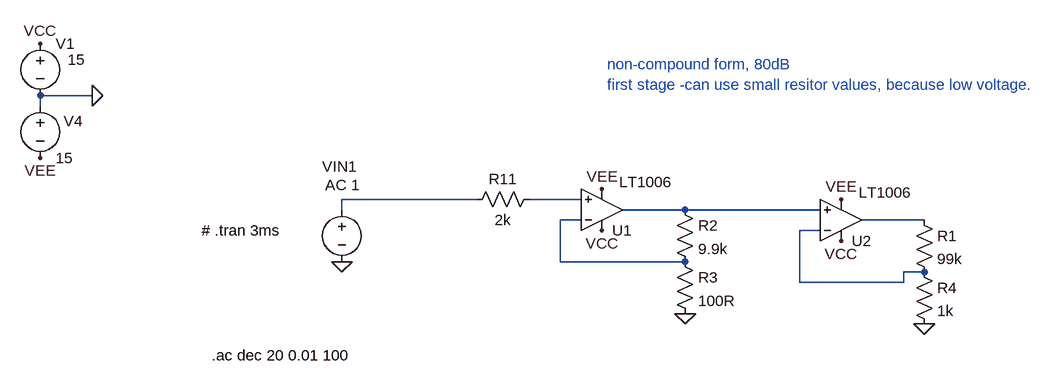
[diagram p0: schematic Draft03.asc]
Draft03.asc, the LTspice schematic file:
Version 4
SHEET 1 2756 2104
WIRE -672 -544 -752 -544
WIRE -752 -528 -752 -544
WIRE -80 -384 -288 -384
WIRE 80 -384 0 -384
WIRE -288 -368 -288 -384
WIRE 240 -368 144 -368
WIRE 448 -368 240 -368
WIRE 80 -352 48 -352
WIRE 608 -352 512 -352
WIRE 448 -336 416 -336
WIRE 48 -288 48 -352
WIRE 240 -288 48 -288
WIRE 608 -272 576 -272
WIRE 416 -256 416 -336
WIRE 576 -256 576 -272
WIRE 576 -256 416 -256
FLAG -752 -624 VCC
FLAG -752 -448 VEE
FLAG 112 -336 VCC
FLAG 112 -400 VEE
FLAG -672 -544 0
FLAG 240 -208 0
FLAG -288 -288 0
FLAG 480 -320 VCC
FLAG 480 -384 VEE
FLAG 608 -192 0
SYMBOL voltage -752 -640 R0
WINDOW 123 0 0 Left 0
WINDOW 39 0 0 Left 0
WINDOW 3 42 41 Left 2
SYMATTR Value 15
SYMATTR InstName V1
SYMBOL voltage -752 -544 R0
WINDOW 123 0 0 Left 0
WINDOW 39 0 0 Left 0
WINDOW 0 36 39 Left 2
SYMATTR InstName V4
SYMATTR Value 15
SYMBOL res -96 -368 R270
WINDOW 0 32 56 VTop 2
WINDOW 3 0 56 VBottom 2
SYMATTR InstName R11
SYMATTR Value 2k
SYMBOL OpAmps\\LT1006 112 -304 M180
WINDOW 3 27 107 Left 2
SYMATTR InstName U1
SYMBOL voltage -288 -384 R0
WINDOW 123 -26 -22 Left 2
WINDOW 39 0 0 Left 0
WINDOW 3 -341 151 Left 2
WINDOW 0 -30 -51 Left 2
SYMATTR Value2 AC 1
SYMATTR Value ""
SYMATTR InstName VIN1
SYMBOL res 224 -384 R0
SYMATTR InstName R2
SYMATTR Value 9.9k
SYMBOL res 224 -304 R0
SYMATTR InstName R3
SYMATTR Value 100R
SYMBOL OpAmps\\LT1006 480 -288 M180
WINDOW 3 27 107 Left 2
SYMATTR InstName U2
SYMBOL res 592 -368 R0
SYMATTR InstName R1
SYMATTR Value 99k
SYMBOL res 592 -288 R0
SYMATTR InstName R4
SYMATTR Value 1k
TEXT -504 -336 Left 2 !# .tran 3ms
TEXT -488 -144 Left 2 !.ac dec 20 0.01 100
TEXT 120 -592 Left 2 ;non-compound form, 80dB\nfirst stage -can use small resitor values, because low voltage.

The netlist it stands for:
* Draft03.asc
V1 VCC 0 15
V4 0 VEE 15
R11 N001 N002 2k
XU1 N002 N004 VCC VEE N003 LT1006  ; pins In+ In- V+ V- OUT
VIN1 N001 0 AC 1
R2 N003 N004 9.9k
R3 N004 0 100R
XU2 N003 N006 VCC VEE N005 LT1006  ; pins In+ In- V+ V- OUT
R1 N005 N006 99k
R4 N006 0 1k
# .tran 3ms
.ac dec 20 0.01 100
* non-compound form, 80dB
* first stage -can use small resitor values, because low voltage.
.lib LTC.lib
.backanno
.end